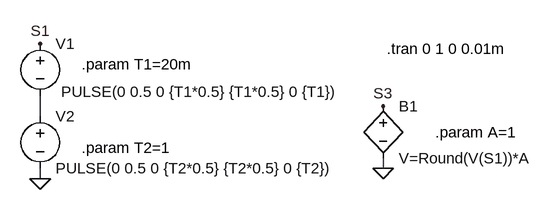
[diagram p0: schematic PWM0.asc]
PWM0.asc, the LTspice schematic file:
Version 4
SHEET 1 1044 680
WIRE 0 160 0 128
WIRE 528 240 528 224
WIRE 0 256 0 240
FLAG 0 48 S1
FLAG 528 240 0
FLAG 0 256 0
FLAG 528 144 S3
SYMBOL bv 528 128 R0
SYMATTR InstName B1
SYMATTR Value V=Round(V(S1))*A
SYMBOL voltage 0 32 R0
WINDOW 3 32 90 Left 0
WINDOW 123 0 0 Left 0
WINDOW 39 0 0 Left 0
SYMATTR Value PULSE(0 0.5 0 {T1*0.5} {T1*0.5} 0 {T1})
SYMATTR InstName V1
SYMBOL voltage 0 144 R0
WINDOW 123 0 0 Left 0
WINDOW 39 0 0 Left 0
SYMATTR InstName V2
SYMATTR Value PULSE(0 0.5 0 {T2*0.5} {T2*0.5} 0 {T2})
TEXT 64 80 Left 0 !.param T1=20m
TEXT 64 208 Left 0 !.param T2=1
TEXT 608 184 Left 0 !.param A=1
TEXT 534 56 Left 0 !.tran 0 1 0 0.01m

The netlist it stands for:
* PWM0.asc
B1 S3 0 V=Round(V(S1))*A
V1 S1 N001 PULSE(0 0.5 0 {T1*0.5} {T1*0.5} 0 {T1})
V2 N001 0 PULSE(0 0.5 0 {T2*0.5} {T2*0.5} 0 {T2})
.param T1=20m
.param T2=1
.param A=1
.tran 0 1 0 0.01m
.backanno
.end